# EAGLE design Placa_processamento_modelo_A (EAGLE 9.5.2)
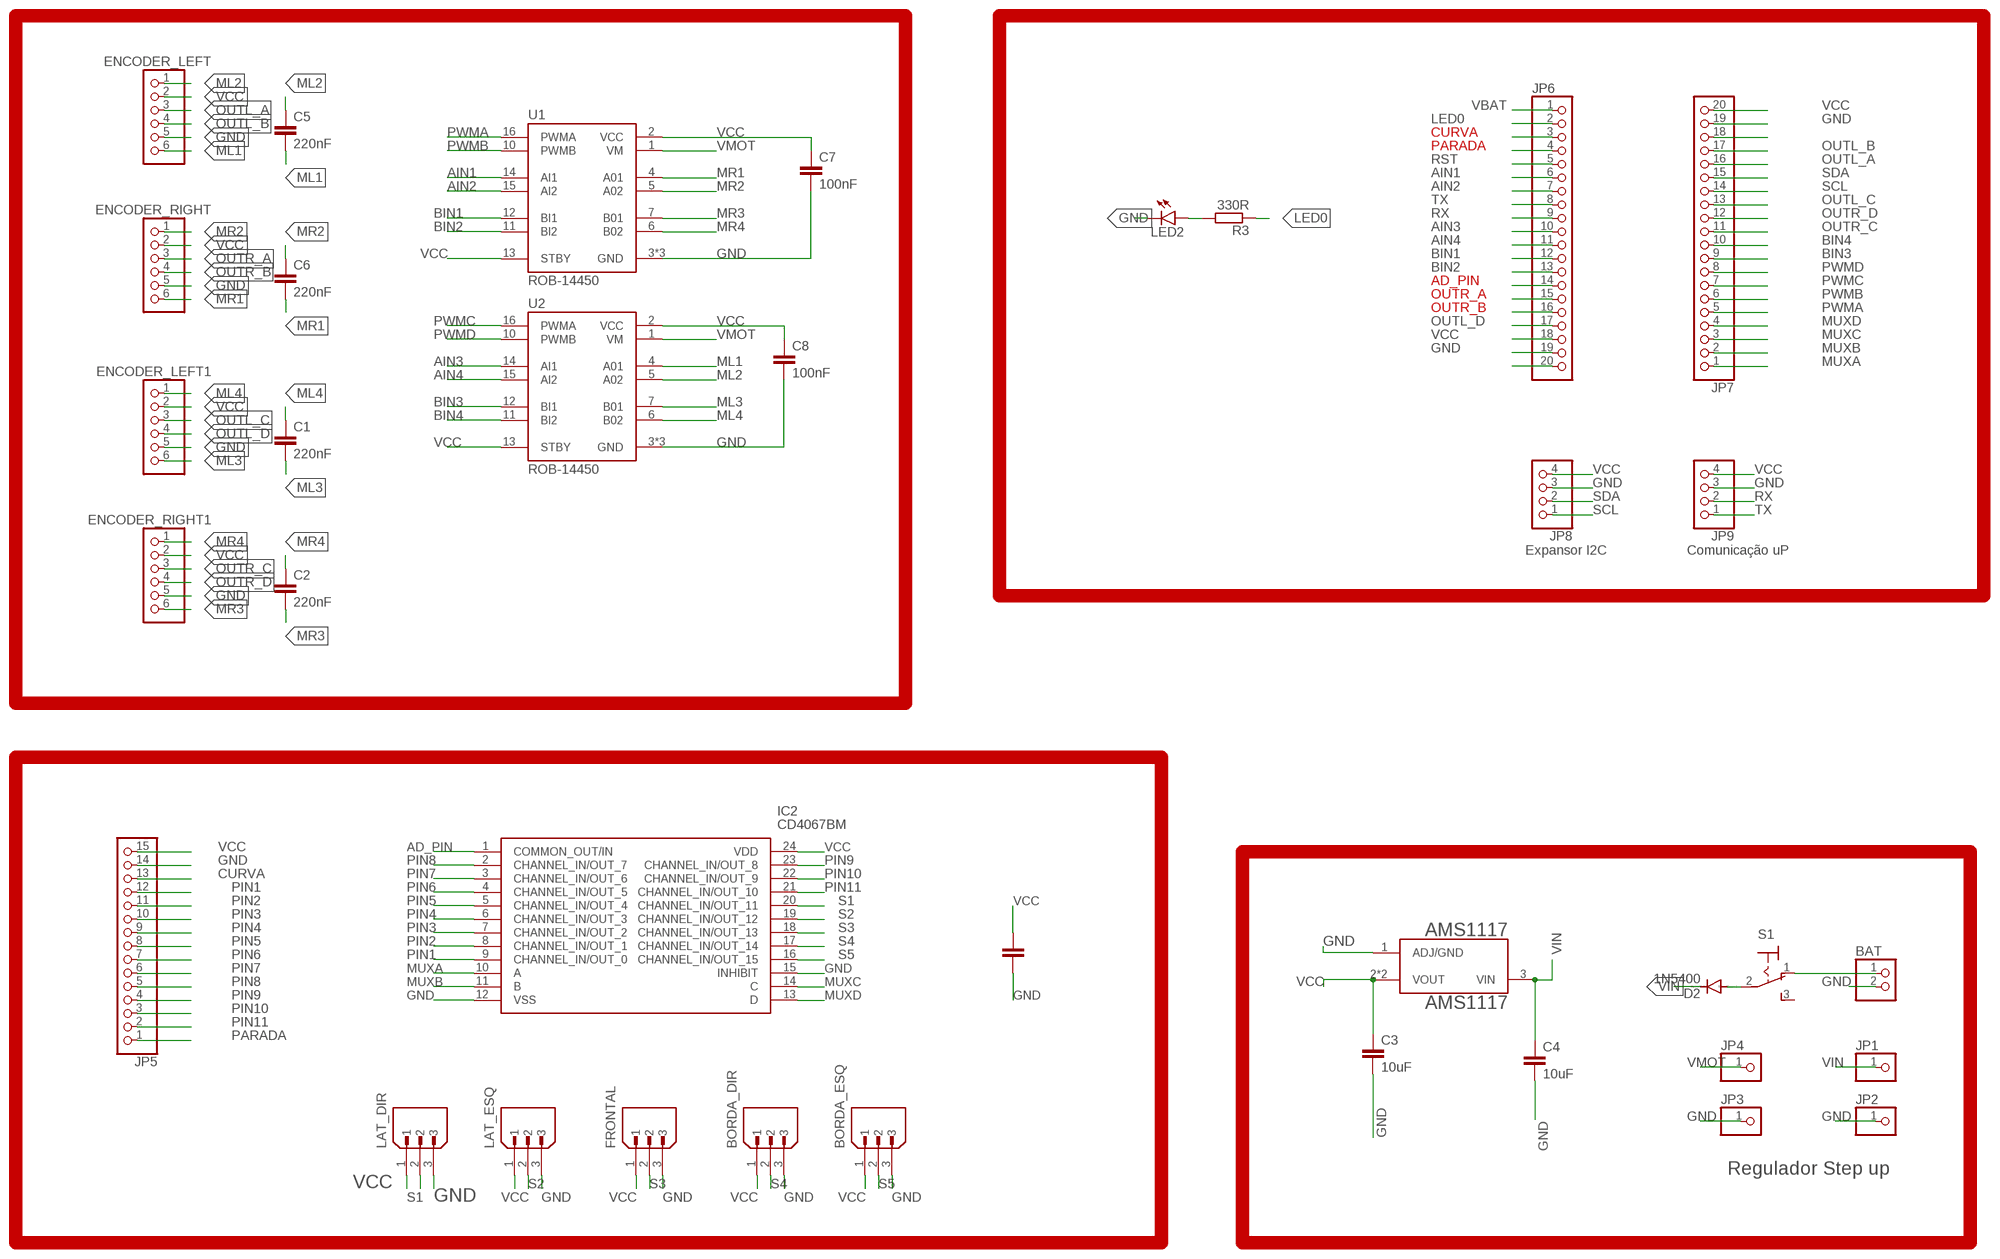
[diagram p0: schematic, sheet 1]

## Parts
AMS1117  AMS1117  [SOT229P700X180-4N]
BAT  PINHD-1X2  [1X02]
BORDA_DIR  B3B-XH-A(LF)(SN)  [JST_B3B-XH-A(LF)(SN)]
BORDA_ESQ  B3B-XH-A(LF)(SN)  [JST_B3B-XH-A(LF)(SN)]
C1  220nF  C-EUC0805  [C0805]
C2  220nF  C-EUC0805  [C0805]
C3  10uF  C-EUC0805  [C0805]
C4  10uF  C-EUC0805  [C0805]
C5  220nF  C-EUC0805  [C0805]
C6  220nF  C-EUC0805  [C0805]
C7  100nF  C-EUC0805  [C0805]
C8  100nF  C-EUC0805  [C0805]
C10  100nF  C-EUC0805  [C0805]
D2  1N5400  [DO201-15]
ENCODER_LEFT  PINHD-1X6  [1X06]
ENCODER_LEFT1  PINHD-1X6  [1X06]
ENCODER_RIGHT  PINHD-1X6  [1X06]
ENCODER_RIGHT1  PINHD-1X6  [1X06]
FRONTAL  B3B-XH-A(LF)(SN)  [JST_B3B-XH-A(LF)(SN)]
IC2  CD4067BM  [SOIC127P1030X265-24N]
JP1  PINHD-1X1  [1X01]
JP2  PINHD-1X1  [1X01]
JP3  PINHD-1X1  [1X01]
JP4  PINHD-1X1  [1X01]
JP5  PINHD-1X15  [1X15]
JP6  PINHD-1X20  [1X20]
JP7  PINHD-1X20  [1X20]
JP8  PINHD-1X4  [1X04]
JP9  PINHD-1X4  [1X04]
LAT_DIR  B3B-XH-A(LF)(SN)  [JST_B3B-XH-A(LF)(SN)]
LAT_ESQ  B3B-XH-A(LF)(SN)  [JST_B3B-XH-A(LF)(SN)]
LED2  LEDCHIPLED_0805  [CHIPLED_0805]
R3  330R  R-EU_R0805  [R0805]
S1  320-916  [320-916]
U1  ROB-14450  [MODULE_ROB-14450]
U2  ROB-14450  [MODULE_ROB-14450]

## Nets
AD_PIN: IC2.1(COMMON_OUT/IN) JP6.14
AIN1: JP6.6 U1.14(AI1)
AIN2: JP6.7 U1.15(AI2)
AIN3: JP6.10 U2.14(AI1)
AIN4: JP6.11 U2.15(AI2)
BIN1: JP6.12 U1.12(BI1)
BIN2: JP6.13 U1.11(BI2)
BIN3: JP7.9 U2.12(BI1)
BIN4: JP7.10 U2.11(BI2)
CURVA: JP5.13 JP6.3
GND: AMS1117.1(ADJ/GND) BAT.2 BORDA_DIR.3 BORDA_ESQ.3 C3.2 C4.2 C7.2 C8.2 C10.2 ENCODER_LEFT1.5 ENCODER_LEFT.5 ENCODER_RIGHT1.5 ENCODER_RIGHT.5 FRONTAL.3 IC2.12(VSS) IC2.15(INHIBIT) JP2.1 JP3.1 JP5.14 JP6.19 JP7.19 JP8.3 JP9.3 LAT_DIR.3 LAT_ESQ.3 LED2.C U1.3(GND) U1.8(GND) U1.9(GND) U2.3(GND) U2.8(GND) U2.9(GND)
LED0: JP6.2 R3.1
ML1: C5.2 ENCODER_LEFT.6 U2.4(A01)
ML2: C5.1 ENCODER_LEFT.1 U2.5(A02)
ML3: C1.2 ENCODER_LEFT1.6 U2.7(B01)
ML4: C1.1 ENCODER_LEFT1.1 U2.6(B02)
MR1: C6.2 ENCODER_RIGHT.6 U1.4(A01)
MR2: C6.1 ENCODER_RIGHT.1 U1.5(A02)
MR3: C2.2 ENCODER_RIGHT1.6 U1.7(B01)
MR4: C2.1 ENCODER_RIGHT1.1 U1.6(B02)
MUXA: IC2.10(A) JP7.1
MUXB: IC2.11(B) JP7.2
MUXC: IC2.14(C) JP7.3
MUXD: IC2.13(D) JP7.4
N$2: D2.A S1.2(P)
N$3: BAT.1 S1.1(O)
N$4: LED2.A R3.2
N$38: JP6.20
NET: JP7.18
OUTL_A: ENCODER_LEFT.3 JP7.16
OUTL_B: ENCODER_LEFT.4 JP7.17
OUTL_C: ENCODER_LEFT1.3 JP7.13
OUTL_D: ENCODER_LEFT1.4 JP6.17
OUTR_A: ENCODER_RIGHT.3 JP6.15
OUTR_B: ENCODER_RIGHT.4 JP6.16
OUTR_C: ENCODER_RIGHT1.3 JP7.11
OUTR_D: ENCODER_RIGHT1.4 JP7.12
PARADA: JP5.1 JP6.4
PIN1: IC2.9(CHANNEL_IN/OUT_0) JP5.12
PIN2: IC2.8(CHANNEL_IN/OUT_1) JP5.11
PIN3: IC2.7(CHANNEL_IN/OUT_2) JP5.10
PIN4: IC2.6(CHANNEL_IN/OUT_3) JP5.9
PIN5: IC2.5(CHANNEL_IN/OUT_4) JP5.8
PIN6: IC2.4(CHANNEL_IN/OUT_5) JP5.7
PIN7: IC2.3(CHANNEL_IN/OUT_6) JP5.6
PIN8: IC2.2(CHANNEL_IN/OUT_7) JP5.5
PIN9: IC2.23(CHANNEL_IN/OUT_8) JP5.4
PIN10: IC2.22(CHANNEL_IN/OUT_9) JP5.3
PIN11: IC2.21(CHANNEL_IN/OUT_10) JP5.2
PWMA: JP7.5 U1.16(PWMA)
PWMB: JP7.6 U1.10(PWMB)
PWMC: JP7.7 U2.16(PWMA)
PWMD: JP7.8 U2.10(PWMB)
RST: JP6.5
RX: JP6.9 JP9.2
S1: IC2.20(CHANNEL_IN/OUT_11) LAT_DIR.2
S2: IC2.19(CHANNEL_IN/OUT_12) LAT_ESQ.2
S3: FRONTAL.2 IC2.18(CHANNEL_IN/OUT_13)
S4: BORDA_DIR.2 IC2.17(CHANNEL_IN/OUT_14)
S5: BORDA_ESQ.2 IC2.16(CHANNEL_IN/OUT_15)
SCL: JP7.14 JP8.1
SDA: JP7.15 JP8.2
TX: JP6.8 JP9.1
VBAT: JP6.1
VCC: AMS1117.2(VOUT) AMS1117.4(VOUT) BORDA_DIR.1 BORDA_ESQ.1 C3.1 C7.1 C8.1 C10.1 ENCODER_LEFT1.2 ENCODER_LEFT.2 ENCODER_RIGHT1.2 ENCODER_RIGHT.2 FRONTAL.1 IC2.24(VDD) JP5.15 JP6.18 JP7.20 JP8.4 JP9.4 LAT_DIR.1 LAT_ESQ.1 U1.2(VCC) U1.13(STBY) U2.2(VCC) U2.13(STBY)
VIN: AMS1117.3(VIN) C4.1 D2.C JP1.1
VMOT: JP4.1 U1.1(VM) U2.1(VM)
Unconnected: S1.3(S)

## Notes on the sheet
- Expansor I2C | Comunicação uP
- Regulador Step up

## Library data of the parts
AMS1117 = AMS1117_REGULADOR:AMS1117: Sot223/Pkg 1-Amp 5-Volt Low Drop Out Voltage Regulatator Check prices <https://pricing.snapeda.com/parts/AMS1117/Advanced%20Monolithic%20Systems/view-part?ref=eda>; AVAILABILITY: In Stock; DESCRIPTION: 1A LOW DROPOUT VOLTAGE REGULATOR SOT-223; MF: Advanced Monolithic Systems; MP: AMS1117; PACKAGE: SOT-223 Seeed Technology; PRICE: None
BAT = pinhead:PINHD-1X2: PIN HEADER
BORDA_DIR BORDA_ESQ FRONTAL LAT_DIR LAT_ESQ = B3B-XH-A_LF__SN_:B3B-XH-A(LF)(SN): Check availability <https://pricing.snapeda.com/parts/B3B-XH-A%28LF%29%28SN%29/JST%20Sales/view-part?ref=eda>; AVAILABILITY: In Stock; DESCRIPTION: Connector Header Through Hole 3 position 0.098 (2.50mm); MF: JST Sales; MP: B3B-XH-A(LF)(SN); PACKAGE: None; PRICE: None; PURCHASE-URL: https://pricing.snapeda.com/search/part/B3B-XH-A(LF)(SN)/?ref=eda
C1-C8 C10 = rcl:C-EU: CAPACITOR, European symbol; SPICEPREFIX: C
D2 = diode:1N5400: DIODE standard rectifier, 3 A, 50 V (Motorola)
ENCODER_LEFT ENCODER_LEFT1 ENCODER_RIGHT ENCODER_RIGHT1 = pinhead:PINHD-1X6: PIN HEADER
IC2 = CD4067BM:CD4067BM: Analog Multiplexer/Demultiplexer SOIC24 Texas Instruments CD4067BM, Multiplexer/Demultiplexer Single 16:1, 3 18 V, 24-Pin SOIC Source: Datasheet <http://www.ti.com/lit/ds/symlink/cd4067b.pdf>; ARROW_PART_NUMBER: CD4067BM; ARROW_PRICE-STOCK: https://www.arrow.com/en/products/cd4067bm/texas-instruments; DESCRIPTION: Analog Multiplexer/Demultiplexer SOIC24 Texas Instruments CD4067BM, Multiplexer/Demultiplexer Single 16:1, 3 18 V, 24-Pin SOIC; HEIGHT: 2.65mm; MANUFACTURER_NAME: Texas Instruments; MANUFACTURER_PART_NUMBER: CD4067BM; MOUSER_PART_NUMBER: 595-CD4067BM; MOUSER_PRICE-STOCK: https://www.mouser.co.uk/ProductDetail/Texas-Instruments/CD4067BM?qs=LSR%252BNeaw%2FwBojsvkXxI5Ew%3D%3D
JP1-JP4 = pinhead:PINHD-1X1: PIN HEADER
JP5 = pinhead:PINHD-1X15: PIN HEADER
JP6 JP7 = pinhead:PINHD-1X20: PIN HEADER
JP8 JP9 = pinhead:PINHD-1X4: PIN HEADER
LED2 = led:LED: LED OSRAM: - CHIPLED LG R971, LG N971, LY N971, LG Q971, LY Q971, LO R971, LY R971 LH N974, LH R974 LS Q976, LO Q976, LY Q976 LO Q996 - Hyper CHIPLED LW Q18S LB Q993, LB Q99A, LB R99A - SideLED LS A670, LO A670, LY A670, LG A670, LP A670 LB A673, LV A673, LT A673, LW A673 LH A674 LY A675 LS A676, LA A676, LO A676, LY A676, LW A676 LS A679, LY A679, LG A679 - Hyper Micro SIDELED® LS Y876, LA Y876, LO Y876, LY Y876 LT Y87S - SmartLED LW L88C, LW L88S LB L89C, LB L89S, LG L890 LS L89K, LO L89K, LY L89K LS L896, LA L896, LO L896, LY L896 - TOPLED LS T670, LO T670, LY T670, LG T670, LP T670 LSG T670, LSP T670, LSY T670, LOP T670, LYG T670 LG T671, LOG T671, LSG T671 LB T673, LV T673, LT T673, LW T673 LH T674 LS T676, LA T676, LO T676, LY T676, LB T676, LH T676, LSB T676, LW T676 LB T67C, LV T67C, LT T67C, LS T67K, LO T67K, LY T67K, LW E67C LS E67B, LA E67B, LO E67B, LY E67B, LB E67C, LV E67C, LT E67C LW T67C LS T679, LY T679, LG T679 LS T770, LO T770, LY T770, LG T770, LP T770 LB T773, LV T773, LT T773, LW T773 LH T774 LS E675, LA E675, LY E675, LS T675 LS T776, LA T776, LO T776, LY T776, LB T776 LHGB T686 LT T68C, LB T68C - Hyper Mini TOPLED® LB M676 - Mini TOPLED Santana® LG M470 LS M47K, LO M47K, LY M47K Source: http://www.osram.convergy.de LUXEON: - LUMILED® LXK2-PW12-R00, LXK2-PW12-S00, LXK2-PW14-U00, LXK2-PW14-V00 LXK2-PM12-R00, LXK2-PM12-S00, LXK2-PM14-U00 LXK2-PE12-Q00, LXK2-PE12-R00, LXK2-PE12-S00, LXK2-PE14-T00, LXK2-PE14-U00 LXK2-PB12-K00, LXK2-PB12-L00, LXK2-PB12-M00, LXK2-PB14-N00, LXK2-PB14-P00, LXK2-PB14-Q00 LXK2-PR12-L00, LXK2-PR12-M00, LXK2-PR14-Q00, LXK2-PR14-R00 LXK2-PD12-Q00, LXK2-PD12-R00, LXK2-PD12-S00 LXK2-PH12-R00, LXK2-PH12-S00 LXK2-PL12-P00, LXK2-PL12-Q00, LXK2-PL12-R00 Source: www.luxeon.com KINGBRIGHT: KA-3528ASYC Source: www.kingbright.com
R3 = rcl:R-EU_: RESISTOR, European symbol; SPICEPREFIX: R
S1 = switch:320-916: TOGGLE SWITCH distributor RS Components
U1 U2 = ROB-14450:ROB-14450: TB6612FNG Motor Controller/Driver Power Management Evaluation Board Check availability <https://pricing.snapeda.com/parts/ROB-14450/SparkFun%20Electronics/view-part?ref=eda>; AVAILABILITY: In Stock; DESCRIPTION: TB6612FNG Motor Controller/Driver Power Management Evaluation Board; MF: SparkFun Electronics; MP: ROB-14450; PACKAGE: None; PRICE: None; PURCHASE-URL: https://pricing.snapeda.com/search/part/ROB-14450/?ref=eda

## Board
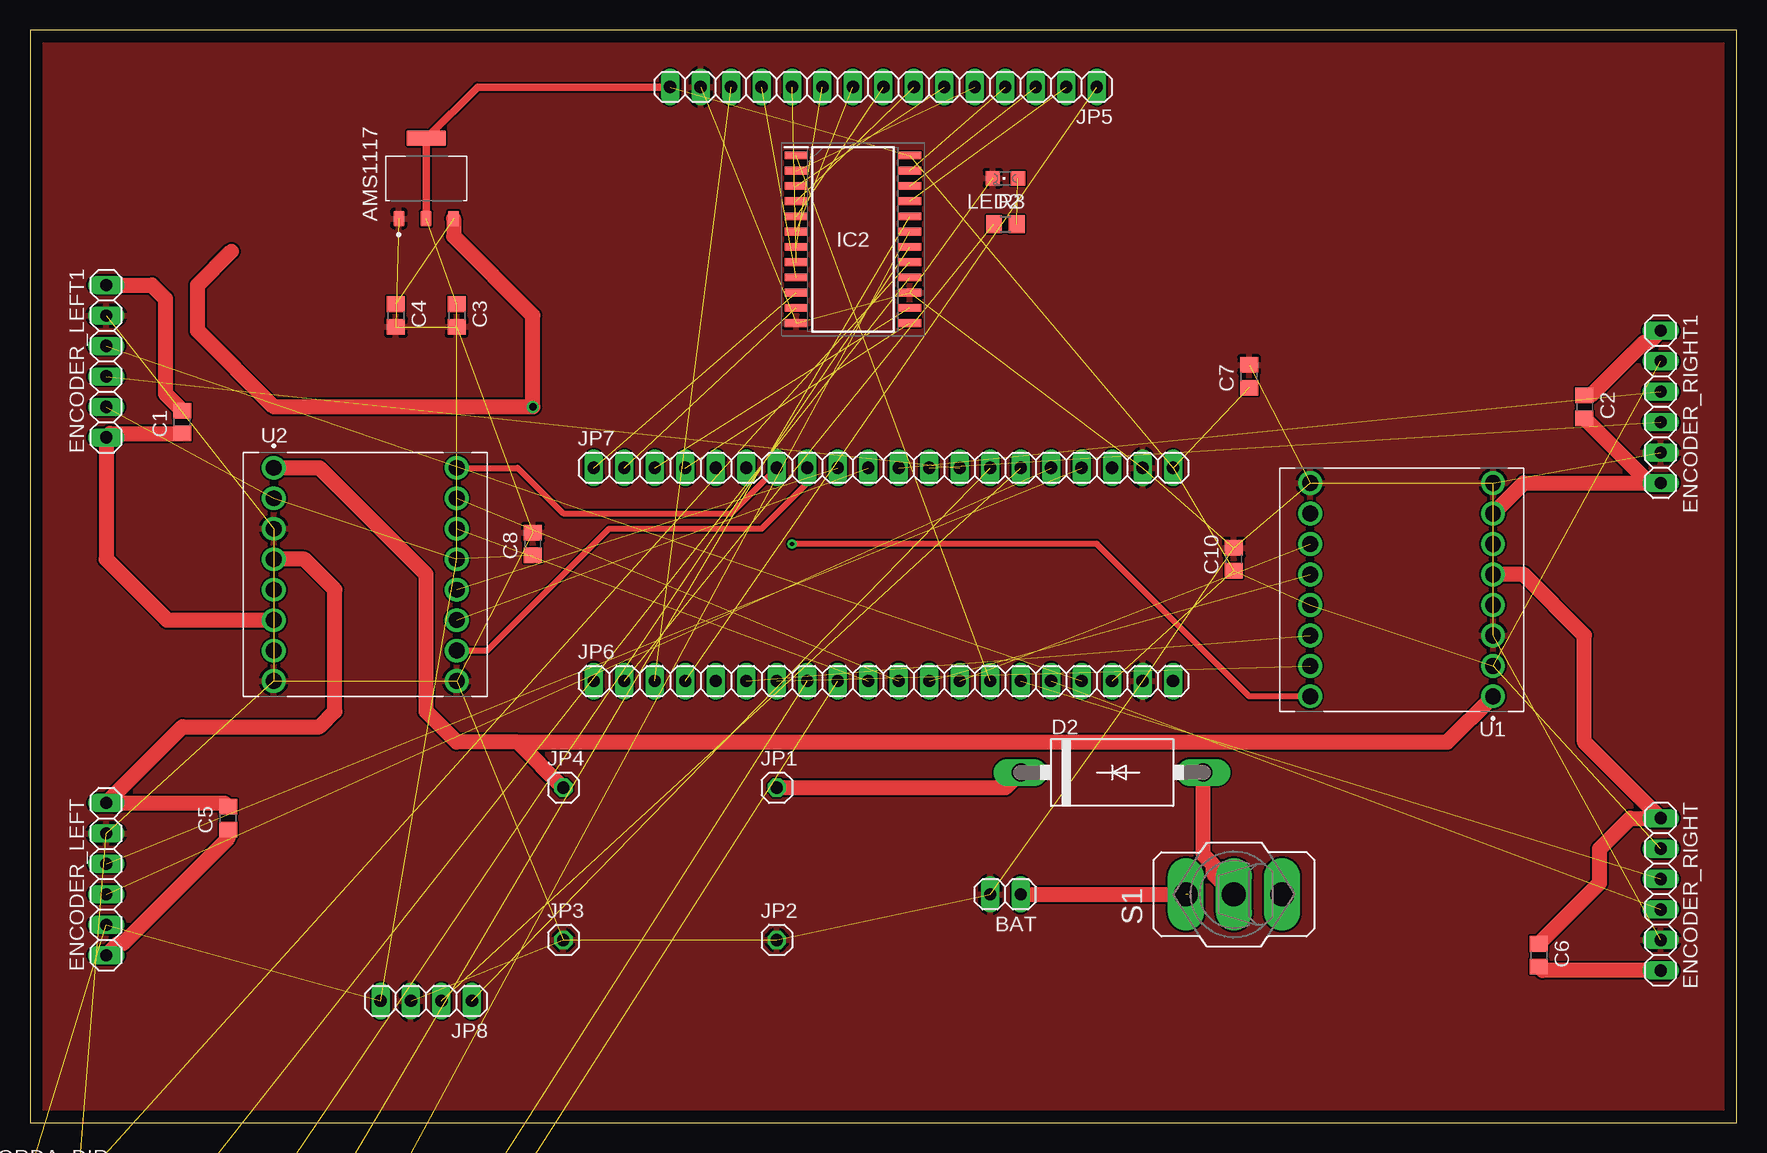
[diagram p1: board, top side]
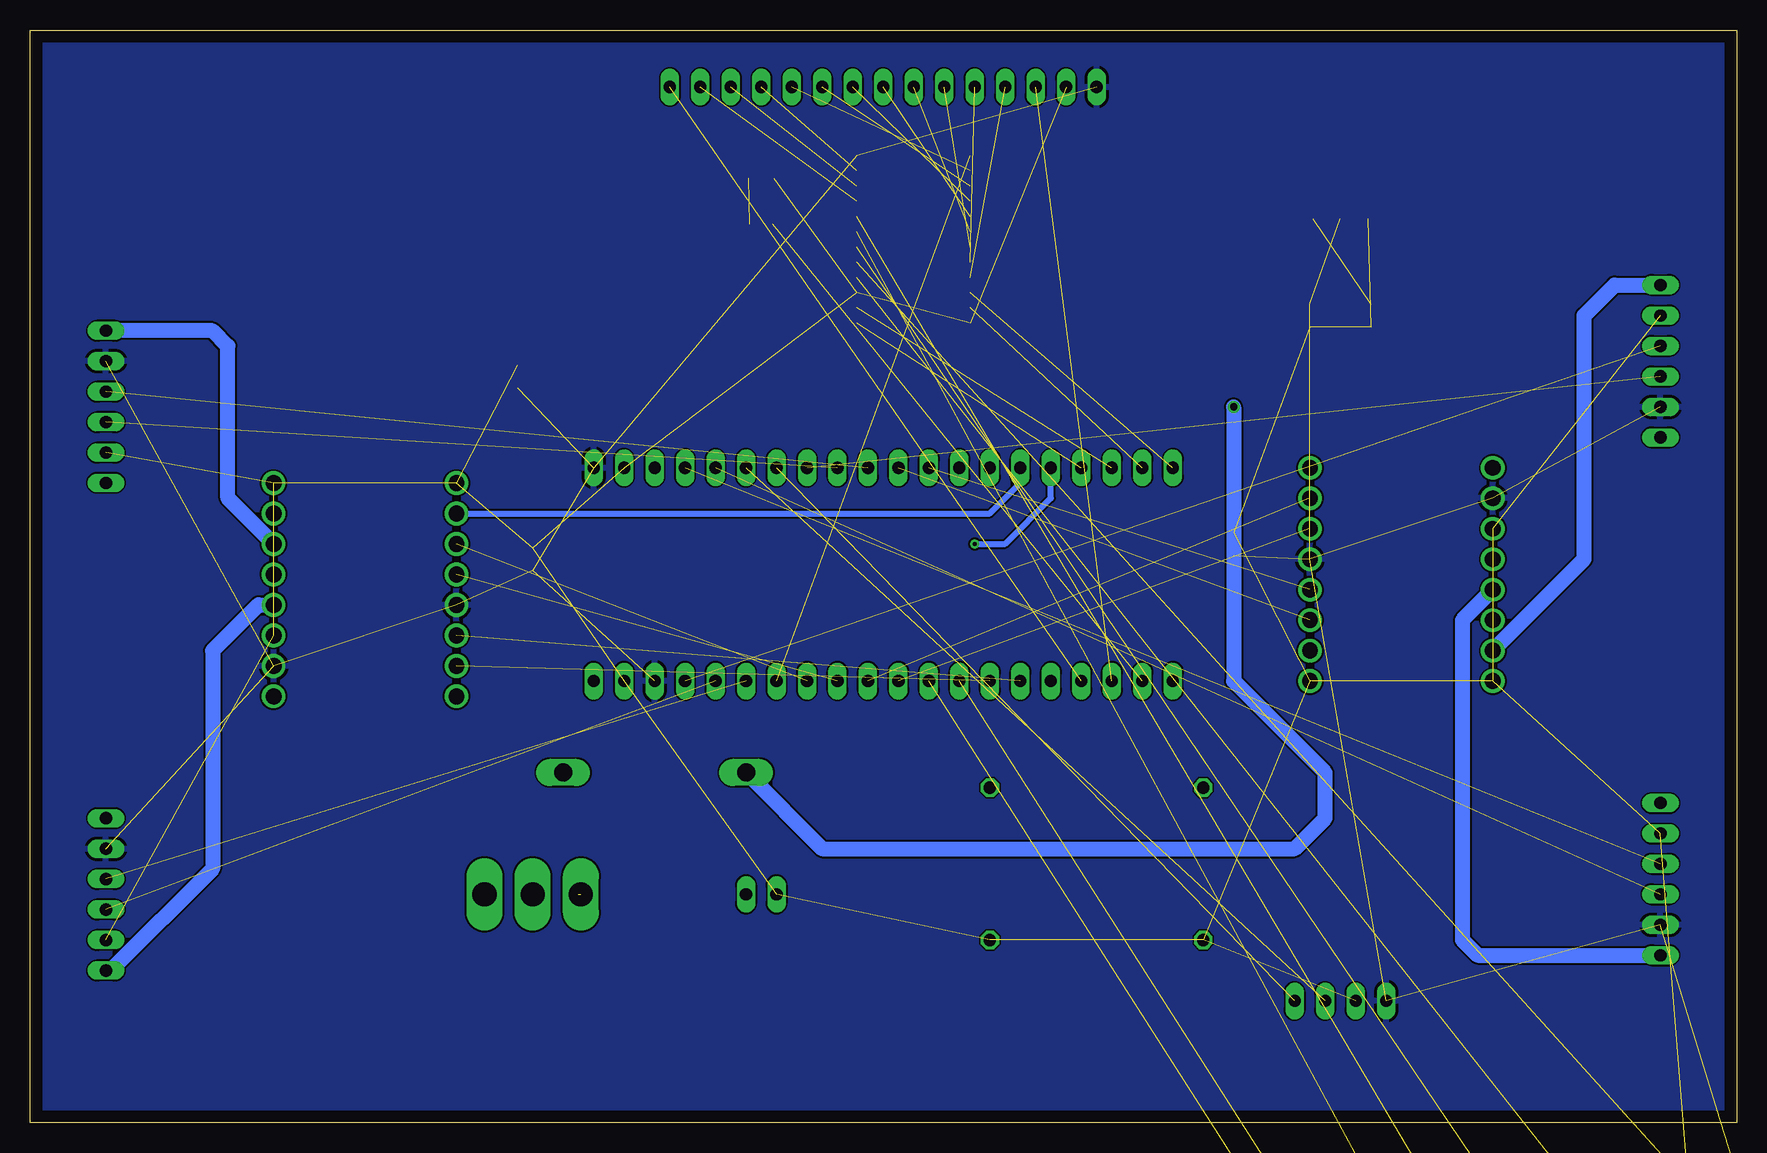
[diagram p2: board, bottom side, seen from below]

Size 142.22 x 91.11 mm. Coordinates in mm from the lower left corner, seen from the top.
Outline: 0,0 142.22,0 142.22,91.11 0,91.11 0,0
Copper layers (1*16): Top 0.035mm / dielectric 1.5mm / Bottom 0.035mm
Design rules "default": minimum track width 6mil, minimum drill 0.35mm, track to track 6mil, track to pad 6mil, pad to pad 6mil, via to via 6mil, smd to smd 6mil, copper to edge 40mil, drill to drill 6mil, minimum pad ring 10mil, minimum via ring 8mil, stop-mask expansion 4mil, vias tented up to drill 0mil, thermal gap 10mil

### Footprints (pad centres in the part's own frame; a part is rotated, then mirrored left to right if it is on the bottom)
SOT229P700X180-4N = smd 1.31 x 0.93: 1 -3.345,2.29; 2 -3.345,0; 3 -3.345,-2.29 | smd 1.31 x 3.24: 4 3.345,0
1X02 = drill 1.016 long: 1 -1.27,0; 2 1.27,0
JST_B3B-XH-A(LF)(SN) = drill 1 square: 1 -2.5,-0.525 | drill 1: 2 0,-0.525; 3 2.5,-0.525
C0805 = smd 1.3 x 1.5: 1 -0.95,0; 2 0.95,0
DO201-15 = drill 1.499 long: A 7.62,0; C -7.62,0
1X06 = drill 1.016 long: 1 -6.35,0; 2 -3.81,0; 3 -1.27,0; 4 1.27,0; 5 3.81,0; 6 6.35,0
SOIC127P1030X265-24N = smd 1.95 x 0.65: 1 -4.725,6.985; 2 -4.725,5.715; 3 -4.725,4.445; 4 -4.725,3.175; 5 -4.725,1.905; 6 -4.725,0.635; 7 -4.725,-0.635; 8 -4.725,-1.905; 9 -4.725,-3.175; 10 -4.725,-4.445; 11 -4.725,-5.715; 12 -4.725,-6.985; 13 4.725,-6.985; 14 4.725,-5.715; 15 4.725,-4.445; 16 4.725,-3.175; 17 4.725,-1.905; 18 4.725,-0.635; 19 4.725,0.635; 20 4.725,1.905; 21 4.725,3.175; 22 4.725,4.445; 23 4.725,5.715; 24 4.725,6.985
1X01 = drill 1.016 octagon: 1 0,0
1X15 = drill 1.016 long: 1 -17.78,0; 2 -15.24,0; 3 -12.7,0; 4 -10.16,0; 5 -7.62,0; 6 -5.08,0; 7 -2.54,0; 8 0,0; 9 2.54,0; 10 5.08,0; 11 7.62,0; 12 10.16,0; 13 12.7,0; 14 15.24,0; 15 17.78,0
1X20 = drill 1.016 long: 1 -24.13,0; 2 -21.59,0; 3 -19.05,0; 4 -16.51,0; 5 -13.97,0; 6 -11.43,0; 7 -8.89,0; 8 -6.35,0; 9 -3.81,0; 10 -1.27,0; 11 1.27,0; 12 3.81,0; 13 6.35,0; 14 8.89,0; 15 11.43,0; 16 13.97,0; 17 16.51,0; 18 19.05,0; 19 21.59,0; 20 24.13,0
1X04 = drill 1.016 long: 1 -3.81,0; 2 -1.27,0; 3 1.27,0; 4 3.81,0
CHIPLED_0805 = smd 1.2 x 1.2: A 0,-1.05; C 0,1.05
R0805 = smd 1.3 x 1.5: 1 -0.95,0; 2 0.95,0
320-916 = drill 2.007 long: 1 0,4.013; 2 0,0; 3 0,-4.013
MODULE_ROB-14450 = drill 1.32: 1 -7.62,8.89; 2 -7.62,6.35; 3 -7.62,3.81; 4 -7.62,1.27; 5 -7.62,-1.27; 6 -7.62,-3.81; 7 -7.62,-6.35; 8 -7.62,-8.89; 9 7.62,-8.89; 10 7.62,-6.35; 11 7.62,-3.81; 12 7.62,-1.27; 13 7.62,1.27; 14 7.62,3.81; 15 7.62,6.35; 16 7.62,8.89

### Placement (x,y rotation side)
AMS1117  33.02,78.74 90 top
BAT  81.28,19.05 180 top
BORDA_DIR  1.27,-7.62 0 top  (outside the outline)
BORDA_ESQ  1.27,-20.32 0 top  (outside the outline)
C1  12.7,58.42 90 top
C2  129.54,59.69 270 top
C3  35.56,67.31 270 top
C4  30.48,67.31 270 top
C5  16.51,25.4 90 top
C6  125.73,13.97 270 top
C7  101.6,62.23 90 top
C8  41.91,48.26 90 top
C10  100.33,46.99 90 top
D2  90.17,29.21 0 top
ENCODER_LEFT  6.35,20.32 90 top
ENCODER_LEFT1  6.35,63.5 90 top
ENCODER_RIGHT  135.89,19.05 270 top
ENCODER_RIGHT1  135.89,59.69 270 top
FRONTAL  1.27,-33.02 0 top  (outside the outline)
IC2  68.58,73.66 0 top
JP1  62.23,27.94 0 top
JP2  62.23,15.24 0 top
JP3  44.45,15.24 0 top
JP4  44.45,27.94 0 top
JP5  71.12,86.36 180 top
JP6  71.12,36.83 0 top
JP7  71.12,54.61 0 top
JP8  33.02,10.16 180 top
JP9  1.27,-68.58 0 top  (outside the outline)
LAT_DIR  1.27,-45.72 0 top  (outside the outline)
LAT_ESQ  1.27,-58.42 0 top  (outside the outline)
LED2  81.28,78.74 90 top
R3  81.28,74.93 0 top
S1  100.33,19.05 90 top
U1  114.3,44.45 180 top
U2  27.94,45.72 0 top

### Tracks (layer width: path | path; a pad name or v marks a point on that pad's centre or on a via)
AD_PIN  (1 unrouted)
AIN1  (1 unrouted)
AIN2  (1 unrouted)
AIN3  (1 unrouted)
AIN4  (1 unrouted)
BIN1  (1 unrouted)
BIN2  (1 unrouted)
BIN3  (1 unrouted)
BIN4  (1 unrouted)
CURVA  (1 unrouted)
GND  (31 unrouted)
  pour Top: -5.08,0 -5.08,95.25 148.59,95.25 148.59,-1.27 -5.08,-1.27
LED0  (1 unrouted)
ML1
  Top 1.27: C5.2 16.19,26.67 ENCODER_LEFT.6 12.7,33.02 24.13,33.02 25.4,34.29 25.4,44.45 22.86,46.99 U2.4
ML2
  Top 1.27: ENCODER_LEFT.1 7.34,14.96 7.75,14.96 16.51,23.72 C5.1
  Bottom 1.27: U2.5 22.86,41.91 22.86,15.24 21.59,13.97 ENCODER_LEFT.1
ML3
  Top 1.27: ENCODER_LEFT1.6 10.16,69.85 11.28,68.73 11.28,60.79 C1.2
  Bottom 1.27: U2.7 12.7,46.99 12.7,67.31 10.16,69.85 ENCODER_LEFT1.6
ML4
  Top 1.27: C1.1 6.67,57.47 ENCODER_LEFT1.1 6.35,46.99 11.43,41.91 U2.6
MR1
  Top 1.27: ENCODER_RIGHT.6 126.05,12.7 C6.2
  Bottom 1.27: U1.4 123.19,43.18 127,39.37 127,21.18 135.48,12.7 ENCODER_RIGHT.6
MR2
  Top 1.27: U1.5 124.46,45.72 129.54,40.64 129.54,31.75 ENCODER_RIGHT.1 133.35,25.4 130.81,22.86 130.81,20 C6.1
MR3
  Top 1.27: U1.7 124.46,53.34 ENCODER_RIGHT1.6 134.94,53.34 C2.2
MR4
  Top 1.27: ENCODER_RIGHT1.1 134.9,65.05 134.49,65.05 130.08,60.64 C2.1
  Bottom 1.27: U1.6 125.73,52.07 125.73,64.77 127,66.04 ENCODER_RIGHT1.1
MUXA  (1 unrouted)
MUXB  (1 unrouted)
MUXC  (1 unrouted)
MUXD  (1 unrouted)
N$2
  Top 1.27: S1.2 98.61,20.77 98.61,21.5 97.79,22.32 D2.A
N$3  (1 unrouted)
  Top 1.27: BAT.1 96.52,19.05
N$4  (1 unrouted)
OUTL_A  (1 unrouted)
OUTL_B  (1 unrouted)
OUTL_C  (1 unrouted)
OUTL_D  (1 unrouted)
OUTR_A  (1 unrouted)
OUTR_B  (1 unrouted)
OUTR_C  (1 unrouted)
OUTR_D  (1 unrouted)
PARADA  (1 unrouted)
PIN1  (1 unrouted)
PIN2  (1 unrouted)
PIN3  (1 unrouted)
PIN4  (1 unrouted)
PIN5  (1 unrouted)
PIN6  (1 unrouted)
PIN7  (1 unrouted)
PIN8  (1 unrouted)
PIN9  (1 unrouted)
PIN10  (1 unrouted)
PIN11  (1 unrouted)
PWMA  (via drill 0.35)
  Top 0.508: U1.16 101.6,35.56 88.9,48.26 v63.5,48.26
  Bottom 0.508: v63.5,48.26 60.96,48.26 57.15,52.07 JP7.5
PWMB
  Bottom 0.508: U1.10 62.23,50.8 59.69,53.34 JP7.6
PWMC
  Top 0.508: U2.16 40.64,54.61 44.45,50.8 58.42,50.8 JP7.7
PWMD
  Top 0.508: U2.10 38.1,39.37 48.26,49.53 60.96,49.53 64.77,53.34 JP7.8
RX  (1 unrouted)
S1  (1 unrouted)
S2  (1 unrouted)
S3  (1 unrouted)
S4  (1 unrouted)
S5  (1 unrouted)
SCL  (1 unrouted)
SDA  (1 unrouted)
TX  (1 unrouted)
VCC  (22 unrouted)
  Top 0.61: JP5.15 37.3,86.36 AMS1117.4 AMS1117.2
  pour Bottom: 0,0 0,91.44 143.51,91.44 143.51,0
VIN  (via drill 0.6)  (1 unrouted)
  Top 1.27: D2.C 81.28,27.94 JP1.1 | AMS1117.3 35.31,73.91 41.91,67.31 v41.91,59.69 20.32,59.69 13.97,66.04 13.97,69.85 16.79,72.67
  Bottom 1.27: D2.C 76.2,22.86 36.83,22.86 34.29,25.4 34.29,29.21 41.91,36.83 v41.91,59.69
VMOT
  Top 1.27: JP4.1 40.64,31.75 | 40.64,31.75 35.56,31.75 33.02,34.29 33.02,45.72 24.13,54.61 U2.1 | 40.64,31.75 118.11,31.75 U1.1